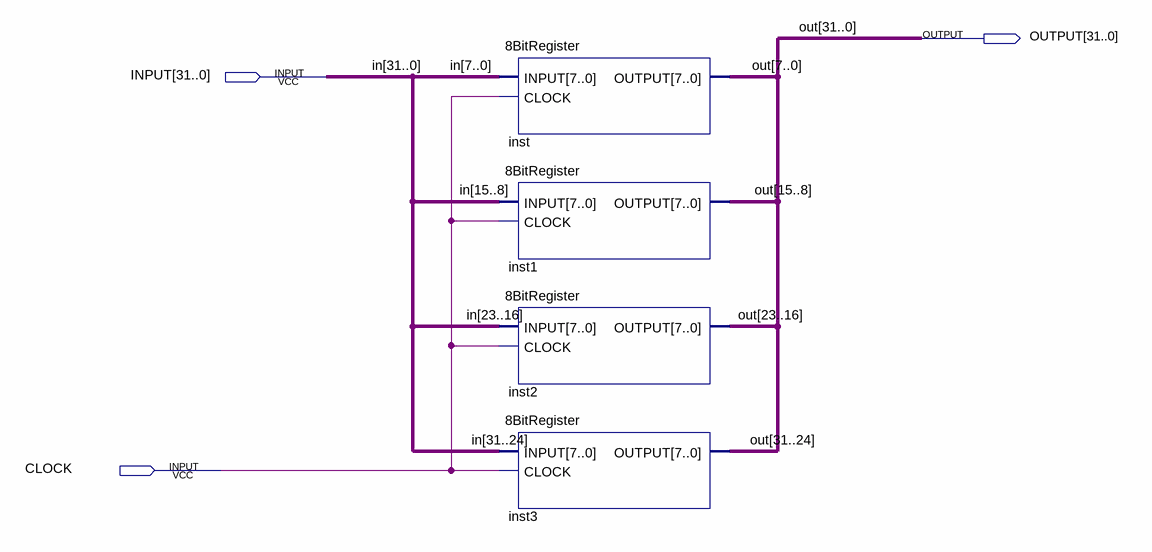
[diagram p0: schematic sheet]
// Quartus schematic 32BitRegister.bdf as structural Verilog: 4 symbols, 3 pins
module \32BitRegister  (
  input  [31:0] INPUT,
  input  CLOCK,
  output [31:0] OUTPUT
);

  \8BitRegister  inst (.INPUT(INPUT[7:0]), .CLOCK(CLOCK), .OUTPUT(OUTPUT[7:0]));
  \8BitRegister  inst1 (.INPUT(INPUT[15:8]), .CLOCK(CLOCK), .OUTPUT(OUTPUT[15:8]));
  \8BitRegister  inst2 (.INPUT(INPUT[23:16]), .CLOCK(CLOCK), .OUTPUT(OUTPUT[23:16]));
  \8BitRegister  inst3 (.INPUT(INPUT[31:24]), .CLOCK(CLOCK), .OUTPUT(OUTPUT[31:24]));

  // Other names for the same wires on the sheet: in[31:0] = INPUT; out[31:0] = OUTPUT
endmodule
